# EasyEDA schematic GP_PCB_1.json
TITLE: Sheet_1; REV: 1.0; Date: 2024-07-02; Sheet: 1/1; Company: Your Company
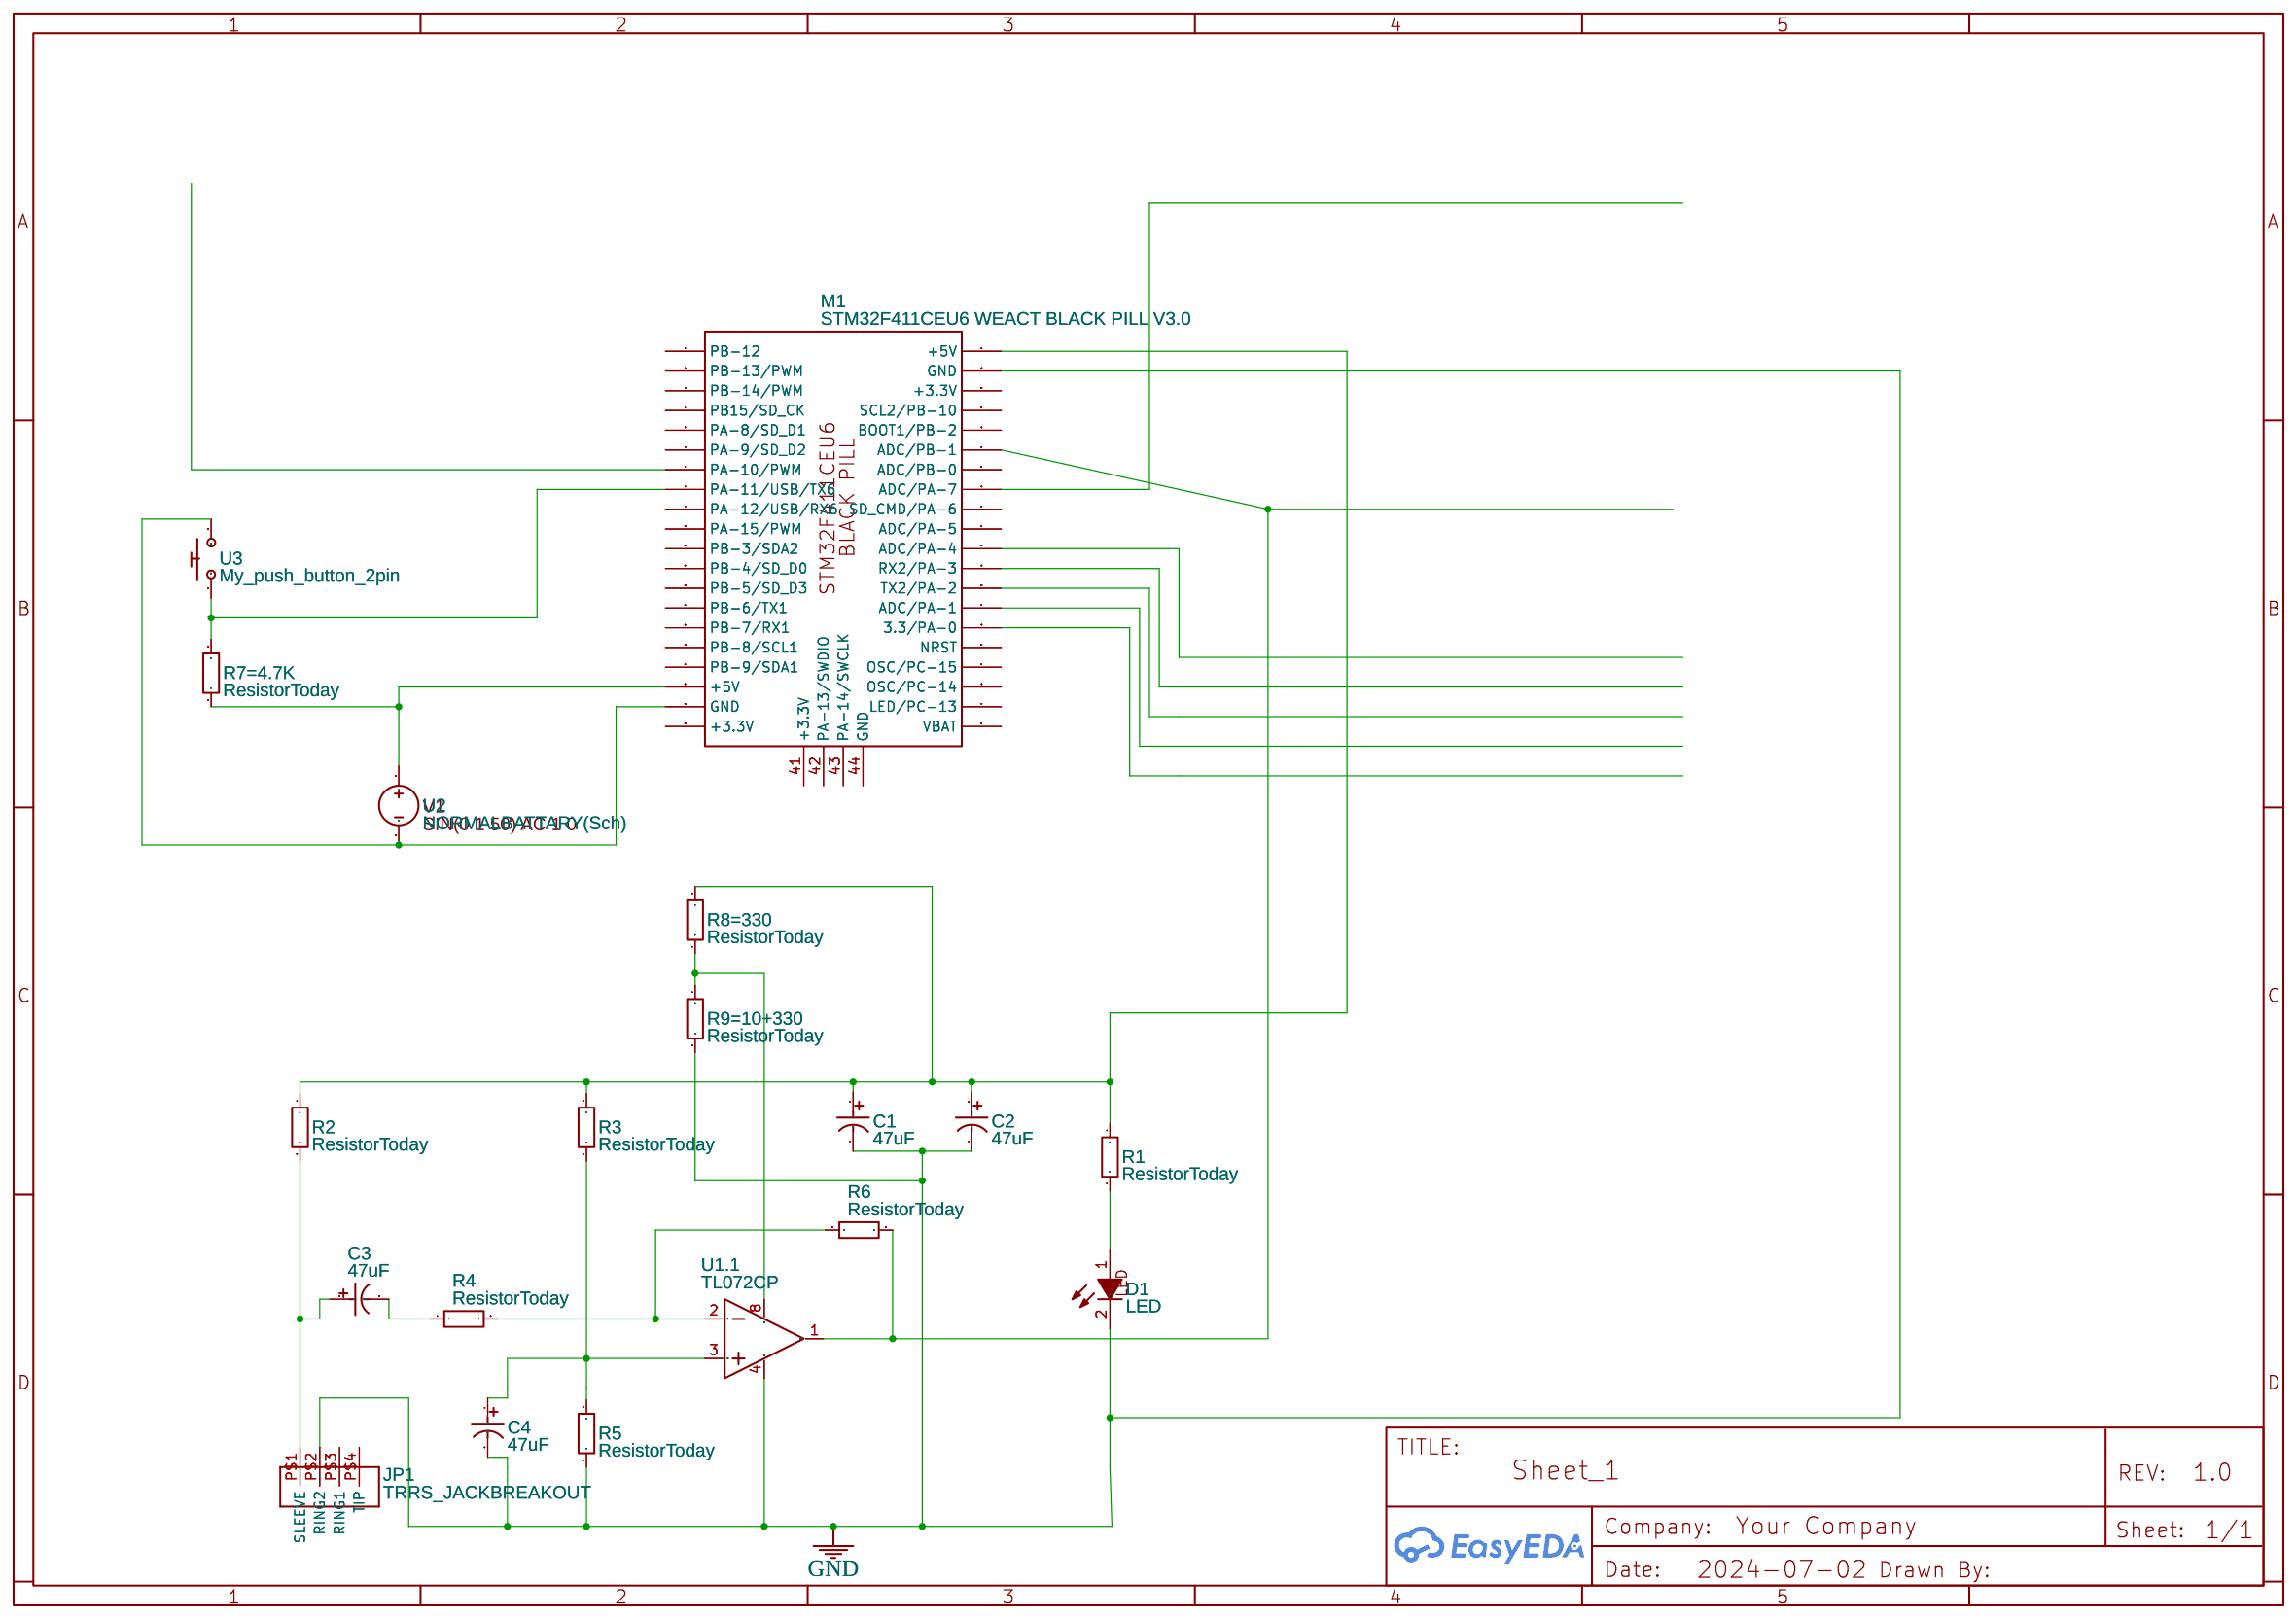
[diagram p0: schematic sheet]

## Parts
C1  47uF  [CAPACITOR, 100UF 2.54MM PIN CAPACITOR]
C2  47uF  [CAPACITOR, 100UF 2.54MM PIN CAPACITOR]
C3  47uF  [CAPACITOR, 100UF 2.54MM PIN CAPACITOR]
C4  47uF  [CAPACITOR, 100UF 2.54MM PIN CAPACITOR]
D1  LED  [LED-TH_LED-DP2-2LED-AMCC]
JP1  TRRS_JACKBREAKOUT  [HEADER-4-PIN-TRRS-JACK-BREAKOUT]
M1  STM32F411CEU6 WEACT BLACK PILL V3.0  [STM32F411CEU6BP]
R1  ResistorToday  [RES35]
R2  ResistorToday  [RES35]
R3  ResistorToday  [RES35]
R4  ResistorToday  [RES35]
R5  ResistorToday  [RES35]
R6  ResistorToday  [RES35]
R7=4.7K  ResistorToday  [RES35]
R8=330  ResistorToday  [RES35]
R9=10+330  ResistorToday  [RES35]
U1  TL072CP  [PIT_DIP-8]  (section 1)
U2  NORMALBATTARY(Sch)  [NORMALBATTARY]
U3  My_push_button_2pin  [MY_PUSH_BUTTON_2PIN]

## Library data of the parts
C1-C4 = CAPACITOR COPY: Manufacturer: CX(承兴); Manufacturer Part: KM476M016D11RR0VH2FP0; JLCPCB Part Class: Extended Part; Contributor: abhishekyr2002
D1 = LED: Supplier: Digi-Key; Manufacturer: VccLite; Manufacturer Part: 5600; Supplier Part: L20325-ND; link: https://vcclite.com/product/5602f5-5v/; Contributor: lionli
JP1 = TRRS_JACKBREAKOUT: Contributor: zaharren
M1 = STM32F411CEU6 WEACT BLACK PILL V3.0: Contributor: Walyson Santos
R1-R6 R7=4.7K R8=330 R9=10+330 = Standard Resistor: Supplier Part: C351613; Manufacturer Part: PTFR0805B130KN9; Contributor: gusteivosgp
U1 = TL072CP: tags: FET Operational Amplifier; Supplier Part: C7236; Supplier: LCSC; Manufacturer: TI; subpart_no: 1
U2 = NORMALBATTARY(Sch): Contributor: S-Pavlov02
U3 = My_push_button_2pin: Contributor: amro43210

## Nets
GND: C1.2 C2.2 C4.2 D1.2(K) JP1.P$2(RING2) M1.39(GND) R5.2 R9=10+330.2 U1.4(VCC-)
Net-(C1-1): C1.1 C2.1 M1.40(+5V) R1.1 R2.1 R3.1 R8=330.1
Net-(C3-1): C3.1 JP1.P$1(SLEEVE) R2.2
Net-(C3-2): C3.2 R4.1
Net-(C4-1): C4.1 R3.2 R5.1 U1.3(IN1+)
Net-(D1-1): D1.1(A) R1.2
Net-(M1-8): M1.8(PA-11/USB/TX6) R7=4.7K.1 U3.1(P$1)
Net-(M1-18): M1.18(+5V) R7=4.7K.2 U2.1
Net-(M1-19): M1.19(GND) U2.2 U3.2(P$2)
Net-(M1-35): M1.35(ADC/PB-1) R6.2 U1.1(OUT1)
Net-(R4-2): R4.2 R6.1 U1.2(IN1-)
Net-(R8=330-2): R8=330.2 R9=10+330.1 U1.8(VCC+)

Not connected (* = marked no-connect by the designer): JP1 P$3(RING1) P$4(TIP); M1 1(PB-12) 2(PB-13/PWM) 3(PB-14/PWM) 4(PB15/SD_CK) 5(PA-8/SD_D1) 6(PA-9/SD_D2) 7(PA-10/PWM) 9(PA-12/USB/RX6) 10(PA-15/PWM) 11(PB-3/SDA2) 12(PB-4/SD_D0) 13(PB-5/SD_D3) 14(PB-6/TX1) 15(PB-7/RX1) 16(PB-8/SCL1) 17(PB-9/SDA1) 20(+3.3V) 21(VBAT) 22(LED/PC-13) 23(OSC/PC-14) 24(OSC/PC-15) 25(NRST) 26(3.3/PA-0) 27(ADC/PA-1) 28(TX2/PA-2) 29(RX2/PA-3) 30(ADC/PA-4) 31(ADC/PA-5) 32(SD_CMD/PA-6) 33(ADC/PA-7) 34(ADC/PB-0) 36(BOOT1/PB-2) 37(SCL2/PB-10) 38(+3.3V) 41(+3.3V) 42(PA-13/SWDIO) 43(PA-14/SWCLK) 44(GND)
